# Altium schematic sheet Microcontroller.SchDoc: Microcontroller
size A4; Revision: AA; SheetNumber: 3; SheetTotal: 4; ImagePath: "D:\git\altium-senior-project\gvsu_logo.jpg"
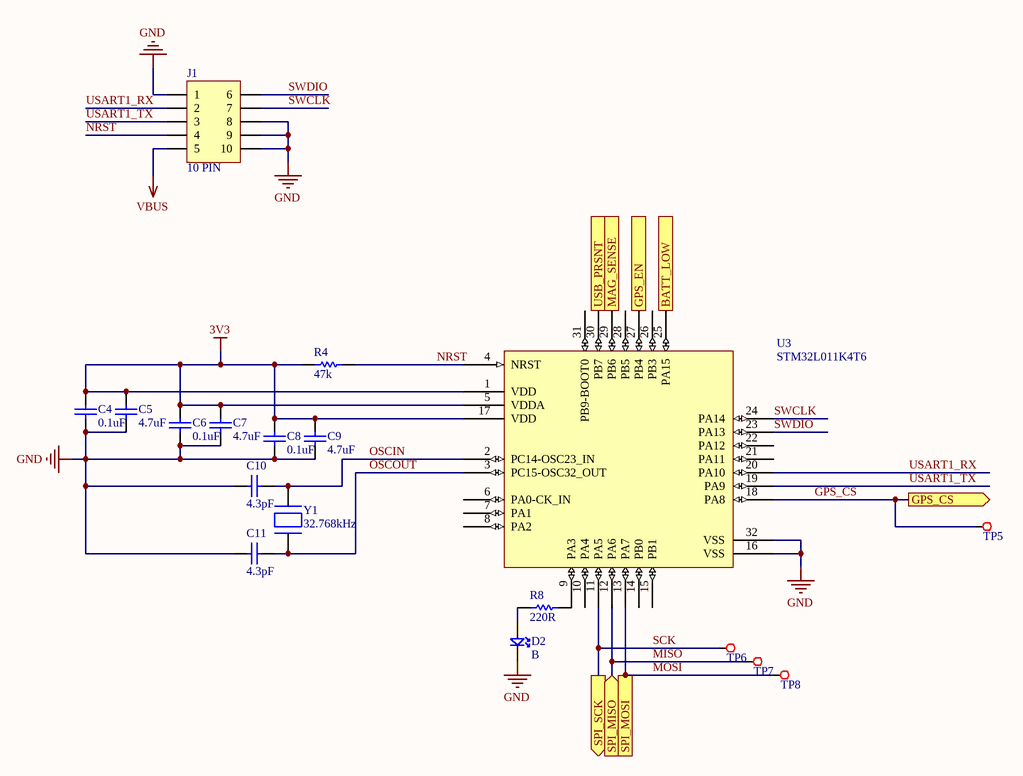
[diagram p0: Microcontroller.SchDoc]

## Parts
C4  value 0.1uF  [0603CAP]  (hidden comment: C0603)
C5  value 4.7uF  [0603CAP]  (hidden comment: C0603)
C6  value 0.1uF  [0603CAP]  (hidden comment: C0603)
C7  value 4.7uF  [0603CAP]  (hidden comment: C0603)
C8  value 0.1uF  [0603CAP]  (hidden comment: C0603)
C9  value 4.7uF  [0603CAP]  (hidden comment: C0603)
C10  value 4.3pF  [0402cap]  (hidden comment: C0402)
C11  value 4.3pF  [0402cap]  (hidden comment: C0402)
D2  value B  [0603DDE]  (hidden comment: D0603)
J1  10 PIN  [FTSH-105-01-F-D-K]
R4  value 47k  [0402RES]  (hidden comment: R0402)
R8  value 220R  [0402RES]  (hidden comment: R0402)
TP5  TESTPOINT  [TP R25]  (value not drawn)  (no BOM)
TP6  TESTPOINT  [TP R35 TH15]  (value not drawn)  (no BOM)
TP7  TESTPOINT  [TP R35 TH15]  (value not drawn)  (no BOM)
TP8  TESTPOINT  [TP R35 TH15]  (value not drawn)  (no BOM)
U3  STM32L011K4T6  [LQFP32]
Y1  32.768kHz  [0.126" L x 0.061" W (2 PAD)]

## Ports
BATT_LOW (in), GPS_CS (out), GPS_EN (out), MAG_SENSE (in), SPI_MISO (in), SPI_MOSI (out), SPI_SCK (out), USB_PRSNT (in)

## Nets
3V3: C4.2 C5.2 C6.2 C7.2 C8.2 C9.2 R4.1 U3.1(VDD) U3.5(VDDA) U3.17(VDD)
GND: C4.1 C5.1 C6.1 C7.1 C8.1 C9.1 C10.1 C11.1 D2.2 J1.1 J1.8 J1.9 J1.10 U3.16(VSS) U3.32(VSS)
VBUS: J1.5
BATT_LOW: U3.25(PA15) ; port BATT_LOW
GPS_CS: TP5.1 U3.18(PA8) ; port GPS_CS
GPS_EN: U3.27(PB4) ; port GPS_EN
MAG_SENSE: U3.29(PB6) ; port MAG_SENSE
MISO: TP7.1 U3.12(PA6) ; port SPI_MISO
MOSI: TP8.1 U3.13(PA7) ; port SPI_MOSI
NRST: J1.4 R4.2 U3.4(NRST)
OSCIN: C10.2 U3.2(PC14-OSC23_IN) Y1.2
OSCOUT: C11.2 U3.3(PC15-OSC32_OUT) Y1.1
SCK: TP6.1 U3.11(PA5) ; port SPI_SCK
SWCLK: J1.7 U3.24(PA14)
SWDIO: J1.6 U3.23(PA13)
USART1_RX: J1.2 U3.20(PA10)
USART1_TX: J1.3 U3.19(PA9)
USB_PRSNT: U3.30(PB7) ; port USB_PRSNT
NetD2_1: D2.1 R8.1
NetR8_2: R8.2 U3.9(PA3)

Not connected (* = marked no-connect by the designer): U3 6(PA0-CK_IN) 7(PA1) 8(PA2) 10(PA4) 14(PB0) 15(PB1) 21(PA11) 22(PA12) 26(PB3) 28(PB5) 31(PB9-BOOT0)

## Notes on the sheet
- Title
- Size:
- Date:
- A4
- Number:
- Time:
- Revision:
- Sheet
- of
- Grand Valley State University
- 301 W Fulton St
- Grand Rapids, MI
- 49504
- File:

## Library data of the parts
C4-C9 = C0603: 0603 Ceramic Chip Capacitor - Standard
C10 C11 = C0402: 0402 Ceramic Chip Capacitor - Standard
D2 = D0603: 0603 SMD LED; ComponentLink1URL: *; Forward Voltage Drop: *
J1 = FTSH-105-01-F-D-K: 10 Pin Programming Header; Manufacturer 1: Samtec Inc.; Manufacturer Part Number 1: FTSH-105-01-F-D-K; Supplier 1: Digikey; Supplier Part Number 1: SAM8909-ND
R4 R8 = R0402: 0402 Chip Resistor - Standard; ComponentLink1URL: *
TP5 = TP25: 0.025" Round Test Point; Part Number: 1613; Part Name: Testpoint
TP6-TP8 = TP35TH10: 0.035"/0.015" Thru Hole Test Point; Part Number: 1617; Part Name: Testpoint
U3 = STM32L011K4T6: STMicro ARM M0+ Microcontroller; Manufacturer 1: STMicroelectronics; Manufacturer Part Number 11: STM32L071KZT6; Supplier 1: Digikey; Supplier Part Number 1: 497-18578-ND
Y1 = NX3215SA-32.768K-STD-MUA-8: NDK RTC 12.5pF Crystal SMD; Manufacturer 1: NDK; Manufacturer Part Number 1: NX3215SA-32.768K-STD-MUA-8; Supplier 1: Digikey; Supplier Part Number 1: 644-1156-1-ND